# EAGLE design 4.5in_touch_LED_driver (EAGLE 7.6.0)
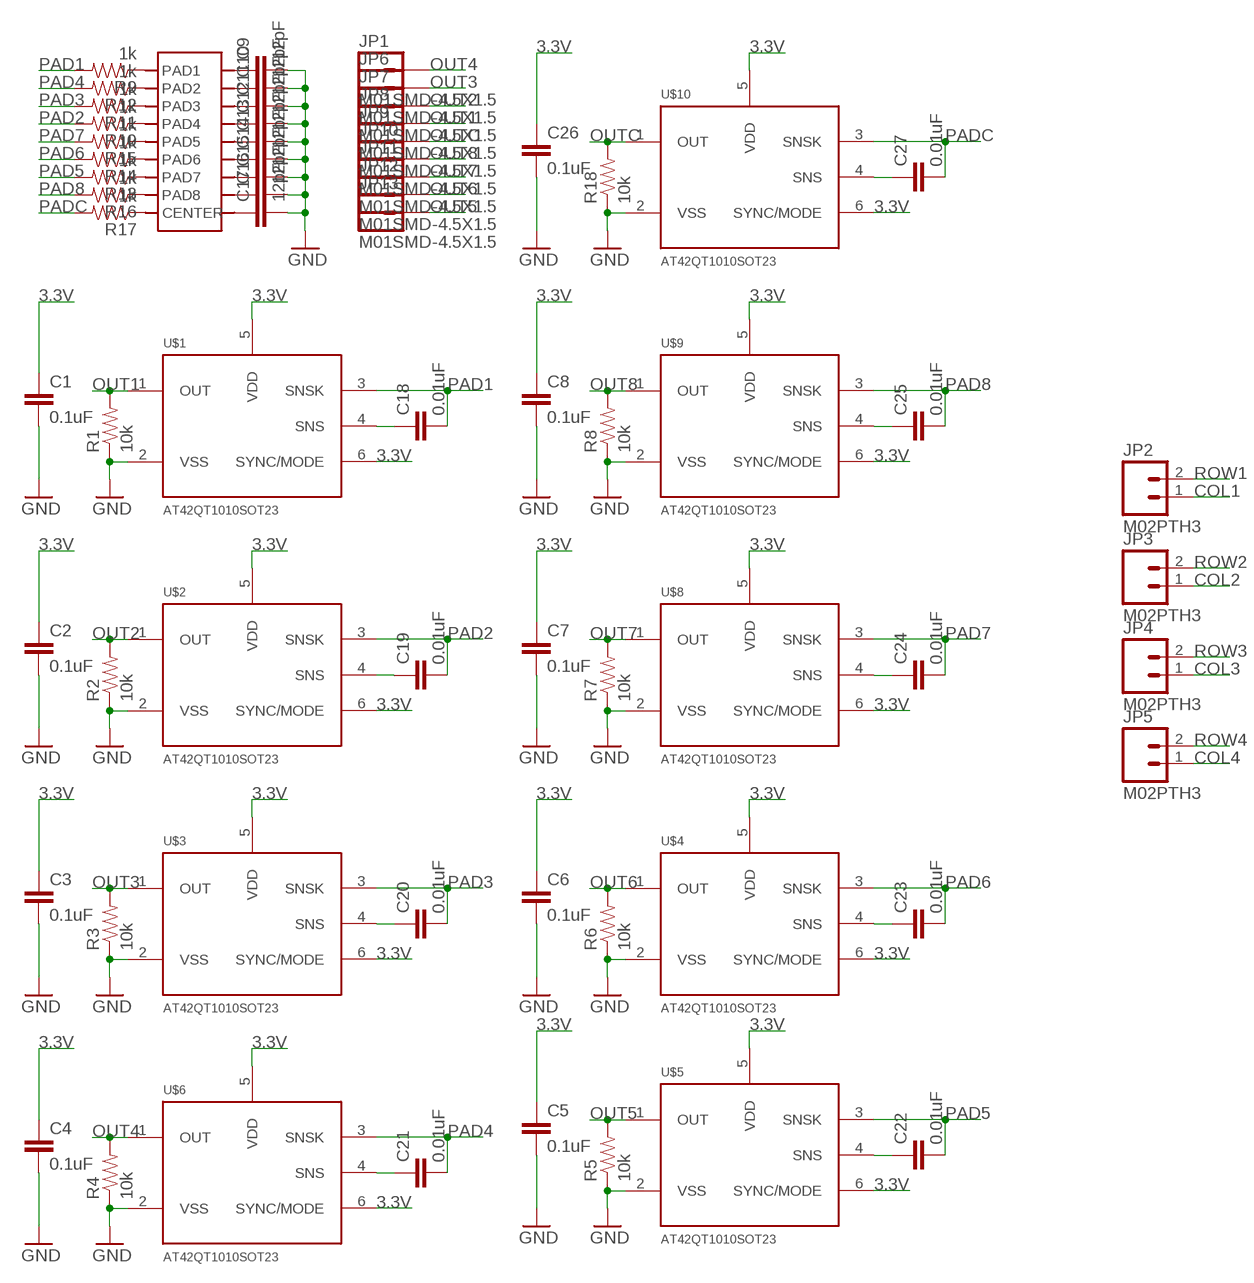
[diagram p0: schematic, sheet 1]

## Parts
C1  0.1uF  0.1UF-25V-5%(0603)  [0603-CAP]
C2  0.1uF  0.1UF-25V-5%(0603)  [0603-CAP]
C3  0.1uF  0.1UF-25V-5%(0603)  [0603-CAP]
C4  0.1uF  0.1UF-25V-5%(0603)  [0603-CAP]
C5  0.1uF  0.1UF-25V-5%(0603)  [0603-CAP]
C6  0.1uF  0.1UF-25V-5%(0603)  [0603-CAP]
C7  0.1uF  0.1UF-25V-5%(0603)  [0603-CAP]
C8  0.1uF  0.1UF-25V-5%(0603)  [0603-CAP]
C9  12pF  CAP0805  [0805]
C10  12pF  CAP0805  [0805]
C11  12pF  CAP0805  [0805]
C12  12pF  CAP0805  [0805]
C13  12pF  CAP0805  [0805]
C14  12pF  CAP0805  [0805]
C15  12pF  CAP0805  [0805]
C16  12pF  CAP0805  [0805]
C17  12pF  CAP0805  [0805]
C18  0.01uF  CAP0805  [0805]
C19  0.01uF  CAP0805  [0805]
C20  0.01uF  CAP0805  [0805]
C21  0.01uF  CAP0805  [0805]
C22  0.01uF  CAP0805  [0805]
C23  0.01uF  CAP0805  [0805]
C24  0.01uF  CAP0805  [0805]
C25  0.01uF  CAP0805  [0805]
C26  0.1uF  0.1UF-25V-5%(0603)  [0603-CAP]
C27  0.01uF  CAP0805  [0805]
JP1  M01SMD-4.5X1.5  [PAD-1.5X4.5]
JP2  M02PTH3  [1X02_LONGPADS]
JP3  M02PTH3  [1X02_LONGPADS]
JP4  M02PTH3  [1X02_LONGPADS]
JP5  M02PTH3  [1X02_LONGPADS]
JP6  M01SMD-4.5X1.5  [PAD-1.5X4.5]
JP7  M01SMD-4.5X1.5  [PAD-1.5X4.5]
JP8  M01SMD-4.5X1.5  [PAD-1.5X4.5]
JP9  M01SMD-4.5X1.5  [PAD-1.5X4.5]
JP10  M01SMD-4.5X1.5  [PAD-1.5X4.5]
JP11  M01SMD-4.5X1.5  [PAD-1.5X4.5]
JP12  M01SMD-4.5X1.5  [PAD-1.5X4.5]
JP13  M01SMD-4.5X1.5  [PAD-1.5X4.5]
R1  10k  RESISTOR0603  [0603-RES]
R2  10k  RESISTOR0603  [0603-RES]
R3  10k  RESISTOR0603  [0603-RES]
R4  10k  RESISTOR0603  [0603-RES]
R5  10k  RESISTOR0603  [0603-RES]
R6  10k  RESISTOR0603  [0603-RES]
R7  10k  RESISTOR0603  [0603-RES]
R8  10k  RESISTOR0603  [0603-RES]
R9  1k  RESISTOR0603  [0603-RES]
R10  1k  RESISTOR0603  [0603-RES]
R11  1k  RESISTOR0603  [0603-RES]
R12  1k  RESISTOR0603  [0603-RES]
R13  1k  RESISTOR0603  [0603-RES]
R14  1k  RESISTOR0603  [0603-RES]
R15  1k  RESISTOR0603  [0603-RES]
R16  1k  RESISTOR0603  [0603-RES]
R17  1k  RESISTOR0603  [0603-RES]
R18  10k  RESISTOR0603  [0603-RES]
U$1  AT42QT1010SOT23  [SOT23-6]
U$2  AT42QT1010SOT23  [SOT23-6]
U$3  AT42QT1010SOT23  [SOT23-6]
U$4  AT42QT1010SOT23  [SOT23-6]
U$5  AT42QT1010SOT23  [SOT23-6]
U$6  AT42QT1010SOT23  [SOT23-6]
U$7  9_PAD_TOUCH4IN  [4IN_TOUCH_PAD]
U$8  AT42QT1010SOT23  [SOT23-6]
U$9  AT42QT1010SOT23  [SOT23-6]
U$10  AT42QT1010SOT23  [SOT23-6]

## Nets
3.3V: C1.1 C2.1 C3.1 C4.1 C5.1 C6.1 C7.1 C8.1 C26.1 U$1.5(VDD) U$1.6(SYNC/MODE) U$2.5(VDD) U$2.6(SYNC/MODE) U$3.5(VDD) U$3.6(SYNC/MODE) U$4.5(VDD) U$4.6(SYNC/MODE) U$5.5(VDD) U$5.6(SYNC/MODE) U$6.5(VDD) U$6.6(SYNC/MODE) U$8.5(VDD) U$8.6(SYNC/MODE) U$9.5(VDD) U$9.6(SYNC/MODE) U$10.5(VDD) U$10.6(SYNC/MODE)
COL1: JP2.1
COL2: JP3.1
COL3: JP4.1
COL4: JP5.1
GND: C1.2 C2.2 C3.2 C4.2 C5.2 C6.2 C7.2 C8.2 C9.2 C10.2 C11.2 C12.2 C13.2 C14.2 C15.2 C16.2 C17.2 C26.2 R1.1 R2.1 R3.1 R4.1 R5.1 R6.1 R7.1 R8.1 R18.1 U$1.2(VSS) U$2.2(VSS) U$3.2(VSS) U$4.2(VSS) U$5.2(VSS) U$6.2(VSS) U$8.2(VSS) U$9.2(VSS) U$10.2(VSS)
N$1: C9.1 U$7.P$10
N$2: C10.1 U$7.P$11
N$3: C11.1 U$7.P$12
N$4: C12.1 U$7.P$13
N$5: C13.1 U$7.P$14
N$6: C14.1 U$7.P$15
N$7: C15.1 U$7.P$16
N$8: C16.1 U$7.P$17
N$9: C17.1 U$7.P$18
N$10: C18.1 U$1.4(SNS)
N$11: C27.1 U$10.4(SNS)
N$12: R9.1 U$7.P$1(PAD1)
N$13: C19.1 U$2.4(SNS)
N$14: C20.1 U$3.4(SNS)
N$15: R10.1 U$7.P$4(PAD4)
N$16: C21.1 U$6.4(SNS)
N$17: R11.1 U$7.P$3(PAD3)
N$18: C22.1 U$5.4(SNS)
N$19: R12.1 U$7.P$2(PAD2)
N$20: C23.1 U$4.4(SNS)
N$21: R13.1 U$7.P$7(PAD7)
N$22: C24.1 U$8.4(SNS)
N$23: R14.1 U$7.P$6(PAD6)
N$24: C25.1 U$9.4(SNS)
N$25: R15.1 U$7.P$5(PAD5)
N$26: R16.1 U$7.P$8(PAD8)
N$27: R17.1 U$7.P$9(CENTER)
OUT1: JP8.P$1 R1.2 U$1.1(OUT)
OUT2: JP7.P$1 R2.2 U$2.1(OUT)
OUT3: JP6.P$1 R3.2 U$3.1(OUT)
OUT4: JP1.P$1 R4.2 U$6.1(OUT)
OUT5: JP13.P$1 R5.2 U$5.1(OUT)
OUT6: JP12.P$1 R6.2 U$4.1(OUT)
OUT7: JP11.P$1 R7.2 U$8.1(OUT)
OUT8: JP10.P$1 R8.2 U$9.1(OUT)
OUTC: JP9.P$1 R18.2 U$10.1(OUT)
PAD1: C18.2 R9.2 U$1.3(SNSK)
PAD2: C19.2 R10.2 U$2.3(SNSK)
PAD3: C20.2 R11.2 U$3.3(SNSK)
PAD4: C21.2 R12.2 U$6.3(SNSK)
PAD5: C22.2 R13.2 U$5.3(SNSK)
PAD6: C23.2 R14.2 U$4.3(SNSK)
PAD7: C24.2 R15.2 U$8.3(SNSK)
PAD8: C25.2 R16.2 U$9.3(SNSK)
PADC: C27.2 R17.2 U$10.3(SNSK)
ROW1: JP2.2
ROW2: JP3.2
ROW3: JP4.2
ROW4: JP5.2

## Library data of the parts
C1-C8 C26 = SparkFun-Capacitors:0.1UF-25V-5%(0603): CAP-08604; PROD_ID: CAP-08604
C9-C25 C27 = SparkFun-Capacitors:CAP: Capacitor Standard 0603 ceramic capacitor, and 0.1" leaded capacitor.
JP1 JP6-JP13 = SparkFun-Connectors:M01: Header 1 Standard 1-pin 0.1" header. Use with straight break away headers (SKU : PRT-00116), right angle break away headers (PRT-00553), swiss pins (PRT-00743), machine pins (PRT-00117), and female headers (PRT-00115).
JP2-JP5 = SparkFun-Connectors:M02: Standard 2-pin 0.1" header. Use with - straight break away headers ( PRT-00116) - right angle break away headers (PRT-00553) - swiss pins (PRT-00743) - machine pins (PRT-00117) - female headers (PRT-00115) Molex polarized connector foot print use with: PRT-08233 with associated crimp pins and housings. 2.54_SCREWTERM for use with PRT-10571. 3.5mm Screw Terminal footprints for PRT-08084 5mm Screw Terminal footprints for use with PRT-08432
R1-R18 = SparkFun-Resistors:RESISTOR: Resistor Basic schematic elements and footprints for 0603, 1206, and PTH resistors.
U$1-U$6 U$8-U$10 = SparkFun-DigitalIC:AT42QT1010
U$7 = IDEO-Sensors:9_PAD_TOUCH

## Board
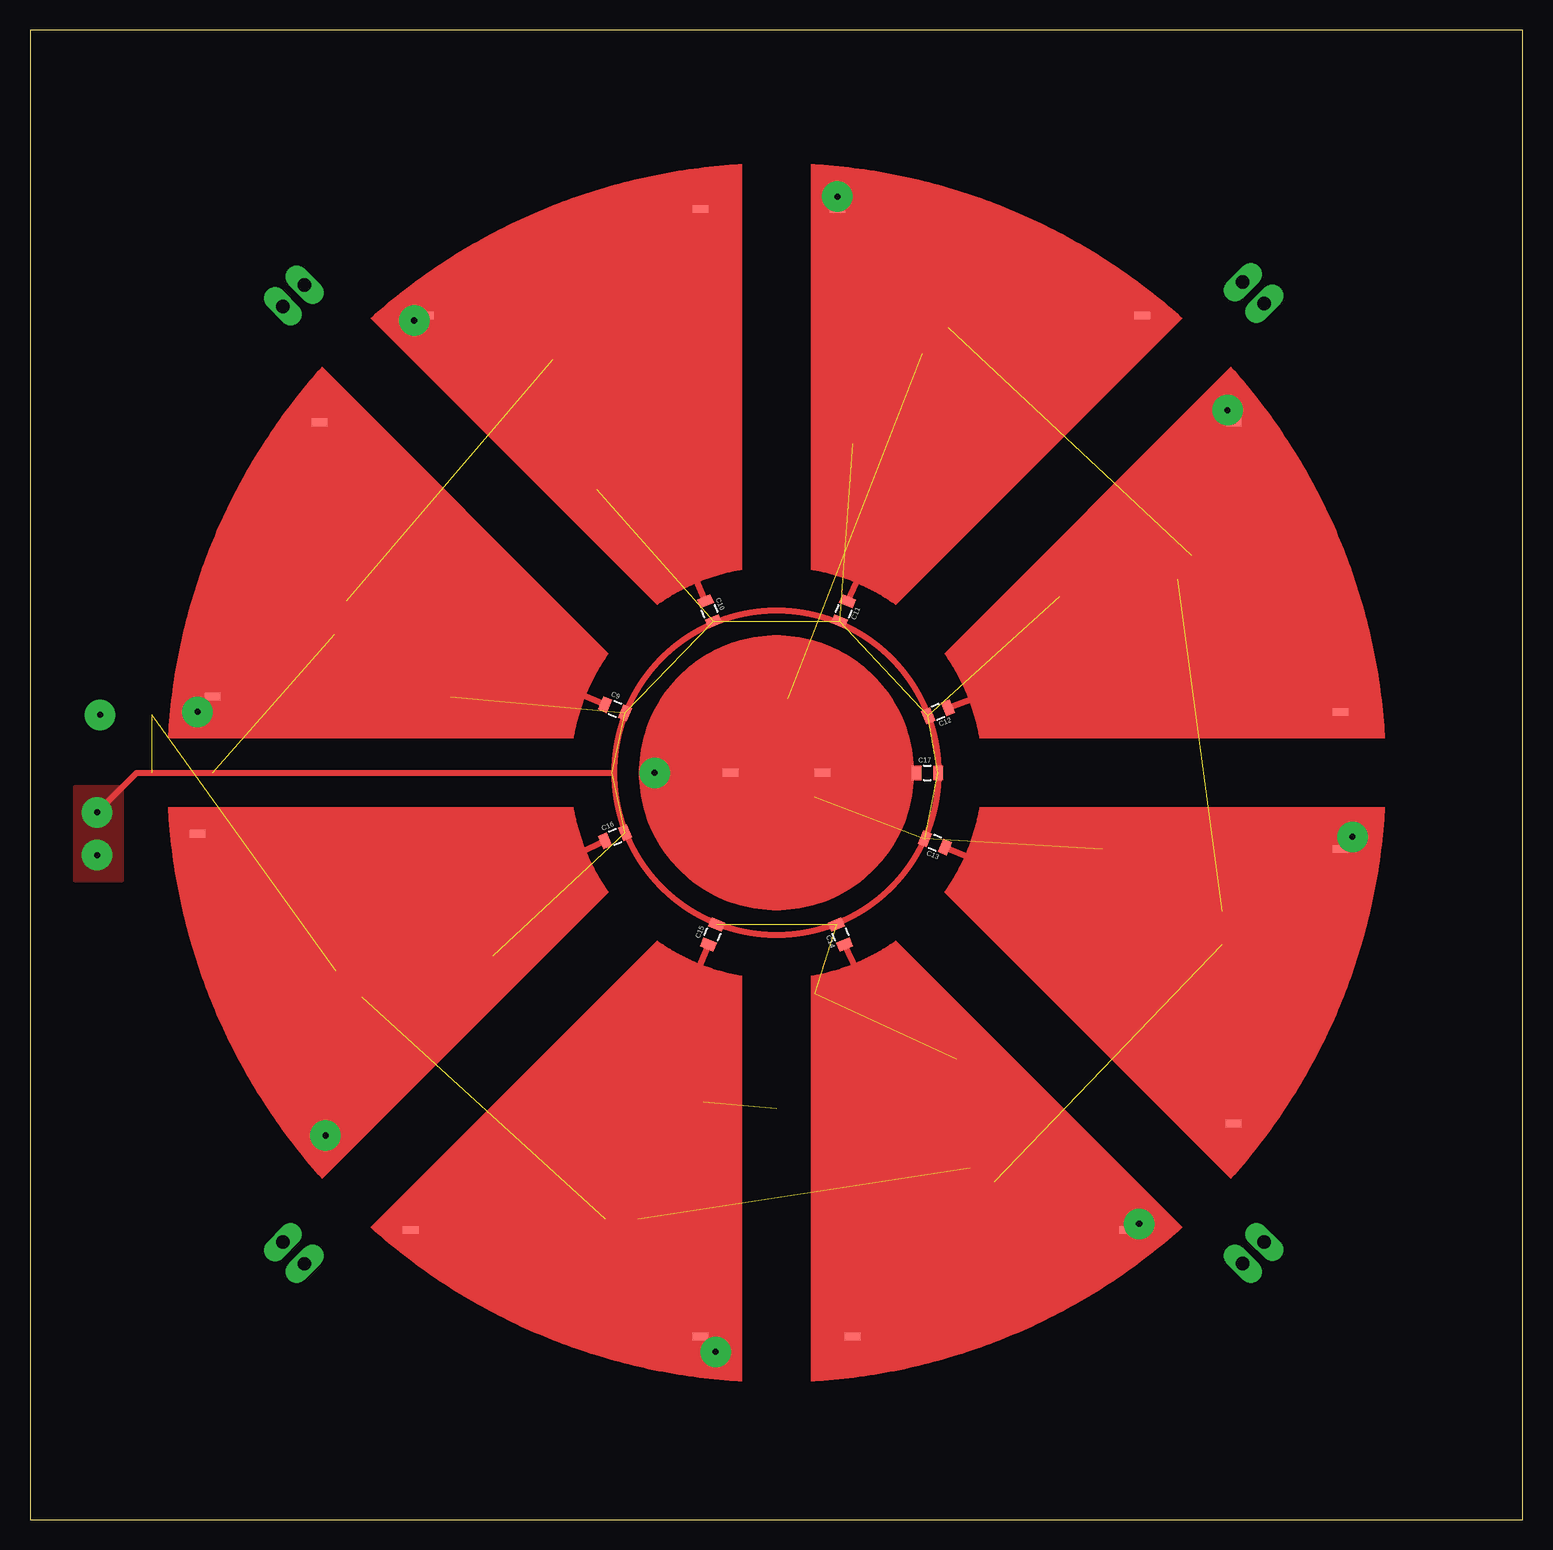
[diagram p1: board, top side]
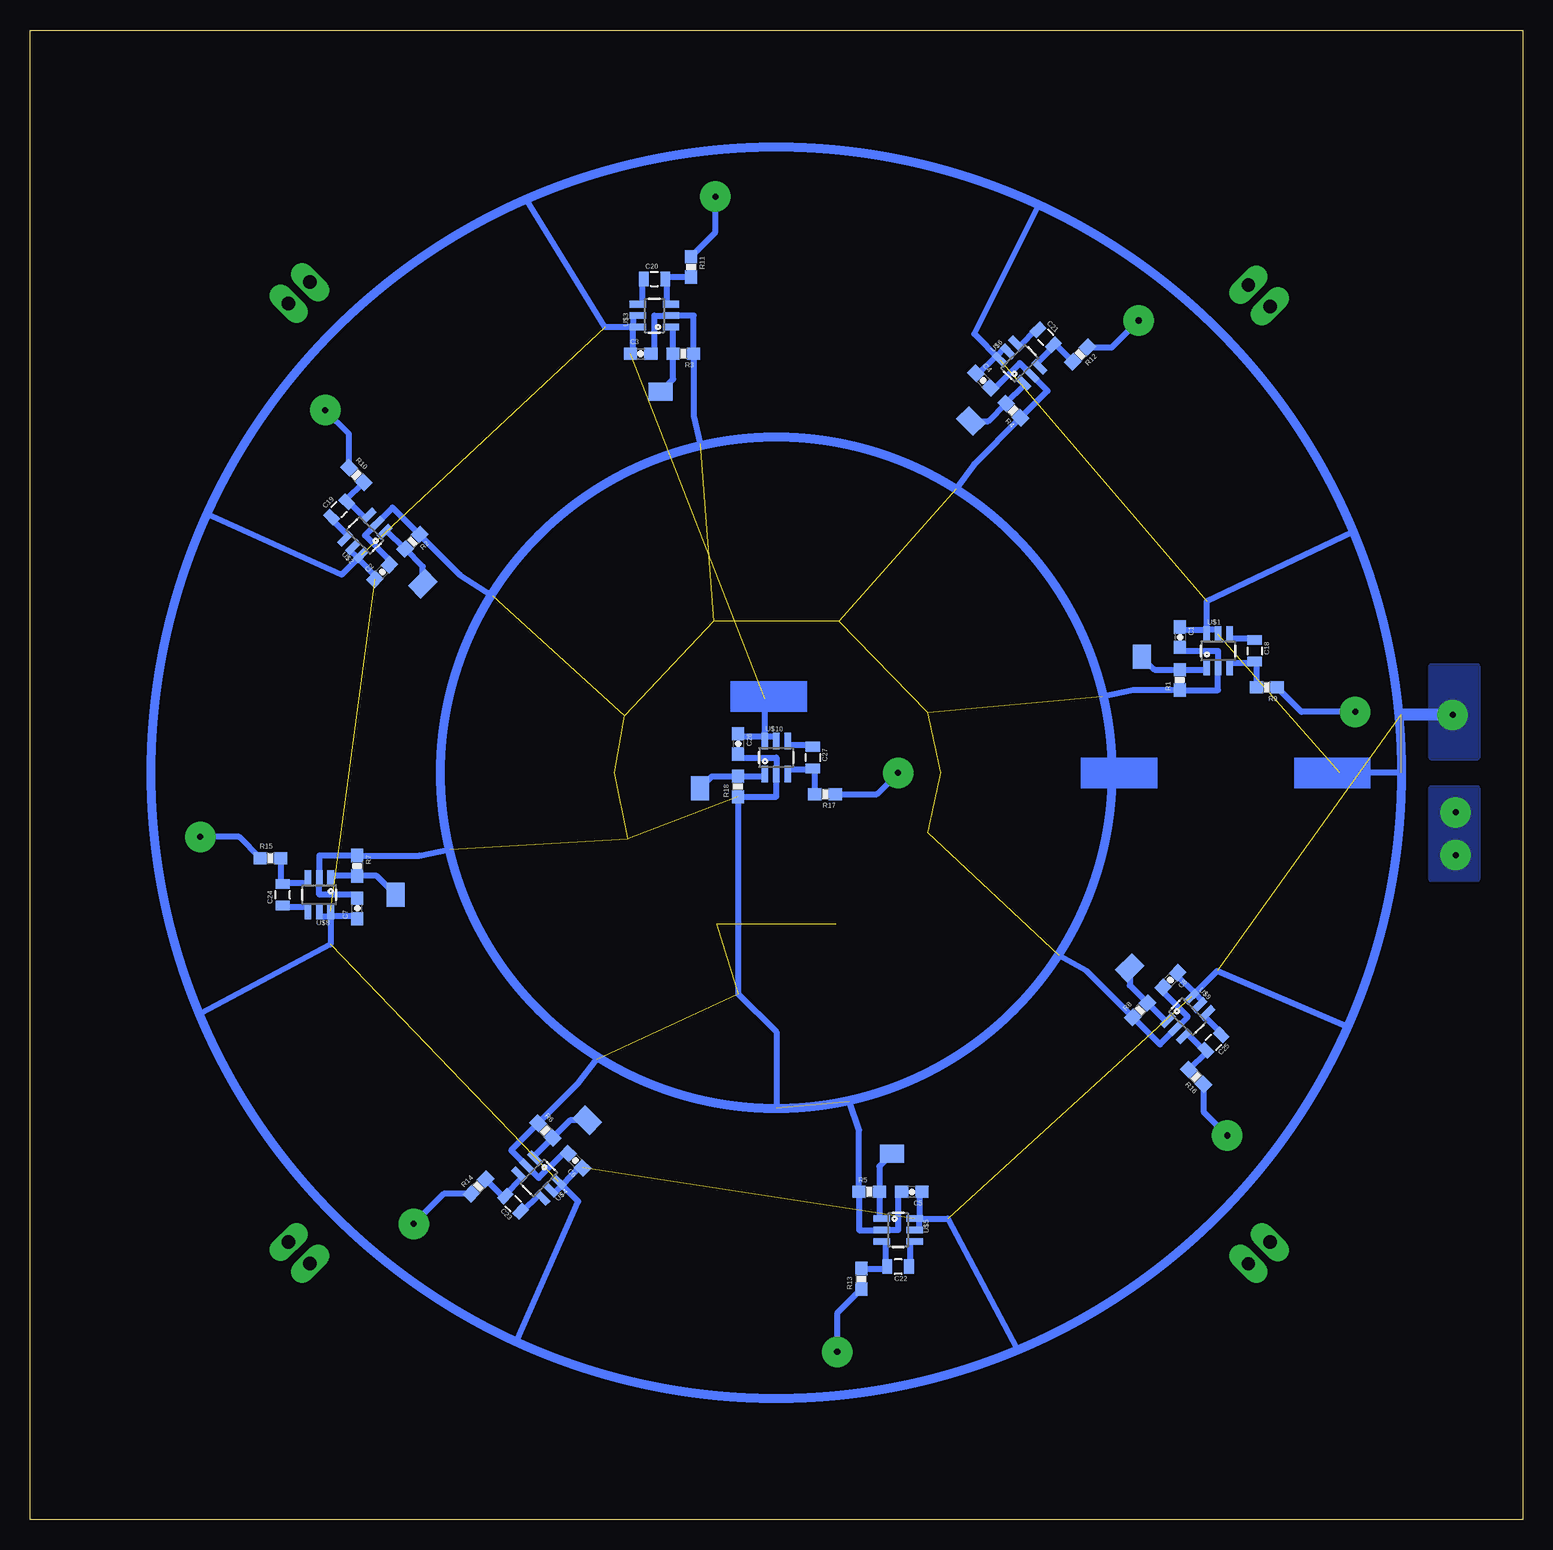
[diagram p2: board, bottom side, seen from below]

Size 124.44 x 124.13 mm. Coordinates in mm from the lower left corner, seen from the top.
Outline: 0,0 124.44,0 124.44,124.13 0,124.13 0,0
Copper layers (1*16): Top 0.035mm / dielectric 1.5mm / Bottom 0.035mm
Design rules "default": minimum track width 10mil, minimum drill 24mil, track to track 8mil, track to pad 8mil, pad to pad 8mil, via to via 8mil, smd to smd 8mil, copper to edge 40mil, drill to drill 8mil, minimum pad ring 10mil, minimum via ring 8mil, stop-mask expansion 4mil, vias tented up to drill 0mil, thermal gap 10mil

### Footprints (pad centres in the part's own frame; a part is rotated, then mirrored left to right if it is on the bottom)
0603-CAP = smd 1.1 x 1: 1 -0.85,0; 2 0.85,0
0805 = smd 0.8 x 1.2: 1 -0.9,0; 2 0.9,0
PAD-1.5X4.5 = smd 1.5 x 2: P$1 0,0
1X02_LONGPADS = drill 1.118 pad 1.88 long: 1 0,0; 2 2.54,0
0603-RES = smd 1.1 x 1: 1 -0.85,0; 2 0.85,0
SOT23-6 = smd 0.55 x 1.35: 1 -0.95,-1.375; 2 0,-1.375; 3 0.95,-1.375; 4 0.95,1.375; 5 0,1.375; 6 -0.95,1.375
4IN_TOUCH_PAD = smd 1.27 x 0.635: P$1 -46.99,6.35; P$2 -6.35,46.99; P$3 5.08,46.99; P$4 46.99,5.08; P$5 46.99,-6.35; P$6 6.35,-46.99; P$7 -6.35,-46.99; P$8 -48.26,-5.08; P$9 -3.81,0; P$10 -38.1,29.21; P$11 -29.21,38.1; P$12 30.48,38.1; P$13 38.1,29.21; P$14 38.1,-29.21; P$15 29.21,-38.1; P$16 -30.48,-38.1; P$17 -38.1,-30.48; P$18 3.81,0

### Placement (x,y rotation side)
C1  28.57,73.53 270 bottom
C2  95.08,78.97 45 bottom
C3  73.53,97.16 0 bottom
C4  44.99,94.93 315 bottom
C5  50.93,27.3 180 bottom
C6  78.97,29.9 135 bottom
C7  97.16,50.93 90 bottom
C8  29.38,44.96 225 bottom
C9  48.77,67.56 337.5 top
C10  56.64,75.69 292.5 top
C11  67.82,75.69 247.5 top
C12  75.69,67.31 202.5 top
C13  75.44,56.39 157.5 top
C14  67.56,48.77 112.5 top
C15  56.9,48.77 67.5 top
C16  48.77,56.9 22.5 top
C17  74.8,62.23 0 top
C18  22.35,72.39 270 bottom
C19  98.68,84.18 45 bottom
C20  72.39,103.38 0 bottom
C21  39.78,98.52 315 bottom
C22  52.07,21.08 180 bottom
C23  84.18,26.31 135 bottom
C24  103.38,52.07 90 bottom
C25  25.78,39.75 225 bottom
C26  65.41,64.64 270 bottom
C27  59.18,63.5 270 bottom
JP1  46,91.54 45 bottom
JP2  101.09,21.34 45 top
JP3  101.09,103.12 315 top
JP4  21.08,101.09 45 top
JP5  21.08,23.11 315 top
JP6  71.88,93.98 90 bottom
JP7  91.69,77.98 315 bottom
JP8  31.75,71.88 0 bottom
JP9  68.58,60.96 0 bottom
JP10  32.77,45.97 315 bottom
JP11  93.98,52.07 0 bottom
JP12  77.98,33.27 45 bottom
JP13  52.58,30.48 270 bottom
R1  28.57,69.98 90 bottom
R2  92.57,81.49 225 bottom
R3  69.98,97.16 180 bottom
R4  42.47,92.41 135 bottom
R5  54.48,27.3 0 bottom
R6  81.49,32.42 315 bottom
R7  97.16,54.48 270 bottom
R8  31.89,42.45 45 bottom
R9  21.34,69.34 180 bottom
R10  97.24,87.05 315 bottom
R11  69.34,104.39 270 bottom
R12  36.9,97.08 225 bottom
R13  55.12,20.07 90 bottom
R14  87.05,27.75 45 bottom
R15  104.39,55.12 0 bottom
R16  27.22,36.88 135 bottom
R17  58.17,60.45 180 bottom
R18  65.41,61.09 90 bottom
U$1  25.4,72.39 0 bottom
U$2  96.52,82.02 135 bottom
U$3  72.39,100.33 90 bottom
U$4  82.02,28.47 225 bottom
U$5  52.07,24.13 270 bottom
U$6  41.93,96.36 45 bottom
U$7  62.23,62.23 0 top
U$8  100.33,52.07 180 bottom
U$9  27.94,41.91 315 bottom
U$10  62.23,63.5 0 bottom

### Tracks (layer width: path | path; a pad name or v marks a point on that pad's centre or on a via)
3.3V  (via drill 0.51 pad 2.54)  (10 unrouted)
  Bottom 0.508: U$2.5 97.78,80.77 97.11,80.09 | 97.11,80.09 95.53,78.52 C2.1 | 97.11,80.09 U$2.6 98.46,78.74 109.73,83.82 | C3.1 74.38,97.28 74.17,97.28 74.17,99.38 | U$3.5 74.17,100.33 74.17,99.38 | 74.17,99.38 U$3.6 76.52,99.38 83.06,109.98 | C1.1 28.45,74.38 28.45,74.17 26.35,74.17 | U$1.5 25.4,74.17 26.35,74.17 | 26.35,74.17 U$1.6 26.35,76.52 14.22,82.3 | C6.1 78.46,29.21 78.61,29.36 80.77,27.21 U$4.5 80.77,27.21 80.77,27.18 79.95,28 79.95,27.74 | C5.1 50.08,27.18 50.29,27.18 50.29,25.08 | U$5.5 50.29,24.13 50.29,25.08 | 50.29,25.08 U$5.6 47.94,25.08 42.16,14.22 | 43.86,96.95 U$6.6 | C7.1 97.28,50.08 97.28,50.29 99.38,50.29 | U$8.5 100.33,50.29 99.38,50.29 | 99.38,50.29 U$8.6 99.38,47.94 110.24,42.16 | C8.1 28.69,45.48 28.84,45.32 27.36,43.84 | U$9.5 26.68,43.17 27.36,43.84 | 27.36,43.84 U$9.6 25.47,45.72 14.73,41.15 | C26.1 65.28,65.49 65.28,65.28 63.18,65.28 | 63.18,65.28 62.23,65.28 U$10.5 | 63.18,65.28 U$10.6 63.18,68.39 | C4.1 45.45,95.39 | 45.45,95.39 45.47,95.37 | 45.45,95.39 43.88,96.96 | 43.88,96.96 43.2,97.64 U$6.5 | U$6.6 43.88,96.96 | U$6.6 45.72,98.81 40.39,109.47 | U$4.6 79.95,27.74 | 79.95,27.74 78.74,26.53 83.82,14.99 | 10.16,62.23 15.24,62.23
  Bottom 1.016: v5.84,67.06 10.16,67.06
  pour Bottom: 7.62,71.12 3.81,71.12 3.81,63.5 7.62,63.5
GND  (via drill 0.51 pad 2.54)  (18 unrouted)
  Top 0.508: 6.35,58.42 6.35,59.69 8.89,62.23 48.51,62.23
  Bottom 0.508: 79.66,30.41 79.87,30.62 82.02,28.47 U$4.2 84.33,30.77 R6.1 78.74,36.37 77.22,38.35 | C4.2 44.29,94.41 44.09,94.21 41.93,96.36 U$6.2 39.62,94.05 R4.1 45.72,87.96 47.24,85.85 | C7.2 97.28,51.78 97.28,52.07 100.33,52.07 U$8.2 100.33,55.33 R7.1 91.99,55.33 89.41,55.88 | C8.2 29.89,44.27 30.09,44.06 27.94,41.91 U$9.2 30.25,39.6 R8.1 36.37,45.72 38.61,46.99 | C26.2 65.28,63.79 65.28,63.5 62.23,63.5 U$10.2 62.23,60.24 R18.1 65.41,43.81 62.23,40.64 62.23,34.29 | C2.2 94.36,79.69 94.36,79.87 96.52,82.02 U$2.2 94.21,84.33 R2.1 88.62,78.74 85.85,76.96 | 79.66,30.41 | 79.66,30.41 C6.2 | C1.2 28.57,72.39 25.4,72.39 U$1.2 25.4,69.13 R1.1 32.47,69.13 35.05,68.58 | C3.2 72.68,97.03 72.64,97.03 72.64,97.28 72.39,97.28 72.39,100.33 U$3.2 69.13,100.33 R3.1 69.13,91.99 68.58,89.66 | C5.2 52.07,27.18 52.07,24.13 U$5.2 55.33,24.13 R5.1 55.33,32.47 56.13,34.8
  other vias: 5.59,58.93 5.59,55.37
  pour Top: 7.62,60.96 3.81,60.96 3.81,53.34 7.62,53.34
  pour Bottom: 7.62,60.96 3.81,60.96 3.81,53.34 7.62,53.34
N$1
  Top 0.508: C9.1 34.29,73.66 U$7.P$10
N$2
  Top 0.508: C10.1 48.26,95.25 U$7.P$11
N$3
  Top 0.508: C11.1 76.2,93.98 U$7.P$12
N$4
  Top 0.508: C12.1 92.71,73.66 U$7.P$13
N$5
  Top 0.508: C13.1 95.25,48.26 U$7.P$14
N$6
  Top 0.508: C14.1 74.93,33.02 U$7.P$15
N$7
  Top 0.508: C15.1 50.8,34.29 U$7.P$16
N$8
  Top 0.508: C16.1 33.02,49.53 U$7.P$17
N$9
  Top 0.508: C17.1 U$7.P$18
N$10
  Bottom 0.508: C18.1 22.35,73.41 24.45,73.41 U$1.4
N$11
  Bottom 0.508: C27.1 59.18,64.52 61.28,64.52 U$10.4
N$12  (via drill 0.51 pad 2.54)
  Top 0.508: U$7.P$1 v13.97,67.31
  Bottom 0.508: v13.97,67.31 18.45,67.31 R9.1
N$13
  Bottom 0.508: C19.1 99.39,83.46 97.91,81.98 U$2.4
N$14
  Bottom 0.508: C20.1 73.41,103.38 73.41,101.28 U$3.4
N$15  (via drill 0.51 pad 2.54)
  Top 0.508: v99.82,92.46 107.95,79.5 U$7.P$4
  Bottom 0.508: R10.1 97.84,90.47 v99.82,92.46
N$16
  Bottom 0.508: C21.1 40.49,99.24 41.98,97.75 U$6.4
N$17  (via drill 0.51 pad 2.54)
  Top 0.508: v67.31,110.24 67.56,109.98 U$7.P$3
  Bottom 0.508: R11.1 67.31,107.28 v67.31,110.24
N$18
  Bottom 0.508: C22.1 51.05,21.08 51.05,23.18 U$5.4
N$19  (via drill 0.51 pad 2.54)
  Top 0.508: v32.03,99.92 44.2,104.14 U$7.P$2
  Bottom 0.508: R12.1 34.26,97.68 v32.03,99.92
N$20
  Bottom 0.508: C23.1 83.46,25.59 81.98,27.08 U$4.4
N$21  (via drill 0.51 pad 2.54)
  Top 0.508: v57.15,13.97 U$7.P$7
  Bottom 0.508: R13.1 57.15,17.18 v57.15,13.97
N$22
  Bottom 0.508: C24.1 103.38,51.05 101.28,51.05 U$8.4
N$23  (via drill 0.51 pad 2.54)
  Top 0.508: v92.46,24.64 88.9,20.32 72.39,20.32 68.58,16.51 U$7.P$6
  Bottom 0.508: R14.1 89.95,27.15 v92.46,24.64
N$24
  Bottom 0.508: C25.1 25.07,40.47 26.55,41.96 U$9.4
N$25  (via drill 0.51 pad 2.54)
  Top 0.508: v110.24,56.9 109.22,56.13 U$7.P$5
  Bottom 0.508: R15.1 107.02,56.9 v110.24,56.9
N$26  (via drill 0.51 pad 2.54)
  Top 0.508: v24.64,32 24.13,46.99 U$7.P$8
  Bottom 0.508: R16.1 26.62,33.99 v24.64,32
N$27  (via drill 0.51 pad 2.54)
  Top 0.508: v52.07,62.23 U$7.P$9
  Bottom 0.508: R17.1 53.85,60.45 v52.07,62.23
OUT1
  Bottom 0.508: U$1.1 26.35,70.83 R1.2 30.7,70.83 JP8.P$1
OUT2
  Bottom 0.508: U$2.1 94.74,82.46 R2.2 91.69,79.41 JP7.P$1
OUT3
  Bottom 0.508: U$3.1 70.83,99.38 R3.2 70.83,95.03 JP6.P$1
OUT4
  Bottom 0.508: U$6.1 41.5,94.59 R4.2 44.55,91.54 JP1.P$1
OUT5
  Bottom 0.508: U$5.1 53.63,25.08 R5.2 53.63,29.43 JP13.P$1
OUT6
  Bottom 0.508: U$4.1 82.46,30.24 R6.2 79.43,33.27 JP12.P$1
OUT7
  Bottom 0.508: U$8.1 99.38,53.63 R7.2 95.54,53.63 JP11.P$1
OUT8
  Bottom 0.508: U$9.1 29.72,41.48 R8.2 32.77,44.53 JP10.P$1
OUTC
  Bottom 0.508: U$10.1 63.18,61.94 R18.2 67.6,61.94 JP9.P$1
PAD1
  Bottom 0.508: U$1.3 24.45,71.37 22.35,71.37 C18.2 22.19,71.49 R9.2
PAD2
  Bottom 0.508: U$2.3 96.47,83.41 97.96,84.9 C19.2 98.16,84.93 R10.2
PAD3
  Bottom 0.508: C20.2 71.37,103.38 | 71.37,103.38 71.37,101.28 U$3.3 | R11.2 71.37,103.54 71.37,103.38
PAD4
  Bottom 0.508: U$6.3 40.54,96.32 39.06,97.8 C21.2 39.02,98 R12.2
PAD5
  Bottom 0.508: U$5.3 53.09,23.18 53.09,21.08 C22.2 52.97,20.92 R13.2
PAD6
  Bottom 0.508: U$4.3 83.41,28.51 84.9,27.03 C23.2 84.93,26.83 R14.2
PAD7
  Bottom 0.508: U$8.3 101.28,53.09 103.38,53.09 C24.2 103.54,52.97 R15.2
PAD8
  Bottom 0.508: U$9.3 27.99,40.52 26.5,39.04 C25.2 26.3,39 R16.2
PADC
  Bottom 0.508: C27.2 59.18,62.48 | 59.18,62.48 61.28,62.48 U$10.3 | R17.2 59.02,62.48 59.18,62.48
(copper drawn outside any net)
  shapes: Bottom area x3, Bottom circle x2, Top circle x1